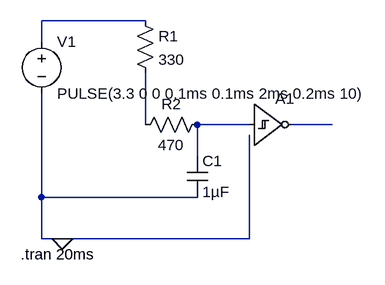
[diagram p0: schematic RSDebounce.asc]
RSDebounce.asc, the LTspice schematic file:
Version 4
SHEET 1 880 680
WIRE 240 96 80 96
WIRE 80 128 80 96
WIRE 240 256 240 176
WIRE 400 256 320 256
WIRE 528 256 464 256
WIRE 320 304 320 256
WIRE 80 368 80 208
WIRE 320 368 80 368
WIRE 80 432 80 368
WIRE 112 432 80 432
WIRE 400 432 400 272
WIRE 400 432 112 432
FLAG 112 432 0
SYMBOL voltage 80 112 R0
WINDOW 123 0 0 Left 2
WINDOW 39 0 0 Left 2
SYMATTR InstName V1
SYMATTR Value PULSE(3.3 0 0 0.1ms 0.1ms 2ms 0.2ms 10)
SYMBOL res 224 80 R0
SYMATTR InstName R1
SYMATTR Value 330
SYMBOL res 336 240 R90
WINDOW 0 0 56 VBottom 2
WINDOW 3 32 56 VTop 2
SYMATTR InstName R2
SYMATTR Value 470
SYMBOL Digital\\schmtinv 400 192 R0
SYMATTR InstName A1
SYMBOL cap 304 304 R0
SYMATTR InstName C1
SYMATTR Value 1µF
TEXT 48 456 Left 2 !.tran 20ms

The netlist it stands for:
* RSDebounce.asc
V1 N001 0 PULSE(3.3 0 0 0.1ms 0.1ms 2ms 0.2ms 10)
R1 N001 N002 330
R2 N003 N002 470
A1 N003 0 0 0 0 N004 0 0 SCHMITT
C1 N003 0 1µF
.tran 20ms
.backanno
.end